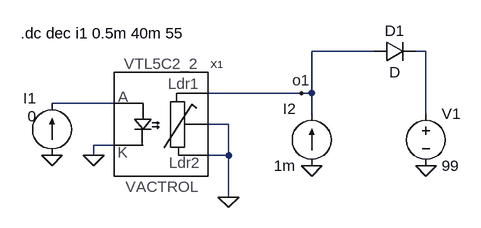
[diagram p0: schematic Test_vtl5c2_2_DC.asc]
Test_vtl5c2_2_DC.asc, the LTspice schematic file:
Version 4
SHEET 1 908 708
WIRE 272 288 272 272
WIRE 304 208 208 208
WIRE 304 272 272 272
WIRE 480 240 448 240
WIRE 480 288 448 288
WIRE 480 288 480 240
WIRE 480 352 480 288
WIRE 592 192 448 192
WIRE 608 192 592 192
WIRE 608 192 608 128
WIRE 608 224 608 192
WIRE 704 128 608 128
WIRE 784 128 768 128
WIRE 784 224 784 128
FLAG 208 288 0
FLAG 608 304 0
FLAG 592 192 o1
FLAG 272 288 0
FLAG 480 352 0
FLAG 784 304 0
SYMBOL vtl5c2_2 352 224 R0
SYMATTR InstName X1
SYMBOL current 208 288 R180
WINDOW 0 24 88 Left 0
WINDOW 3 24 60 Left 0
WINDOW 123 0 0 Left 0
WINDOW 39 0 0 Left 0
SYMATTR InstName I1
SYMATTR Value 0
SYMBOL current 608 304 R180
WINDOW 0 24 88 Left 0
WINDOW 3 24 0 Left 0
WINDOW 123 0 0 Left 0
WINDOW 39 0 0 Left 0
SYMATTR InstName I2
SYMATTR Value 1m
SYMBOL voltage 784 208 R0
WINDOW 123 0 0 Left 0
WINDOW 39 0 0 Left 0
SYMATTR InstName V1
SYMATTR Value 99
SYMBOL diode 704 144 R270
WINDOW 0 32 32 VTop 0
WINDOW 3 0 32 VBottom 0
SYMATTR InstName D1
TEXT 160 100 Left 0 !.dc dec i1 0.5m 40m 55

The netlist it stands for:
* Test_vtl5c2_2_DC.asc
XX1 N001 0 o1 0 0 vtl5c2_2  ; pins A K Ldr1 Ldr2 Tab
I1 0 N001 0
I2 0 o1 1m
V1 N002 0 99
D1 o1 N002 D
.model D D
.lib standard.dio
.dc dec i1 0.5m 40m 55
.backanno
.end